# Altium schematic sheet [03] - 28PINS SCHEMATIC.SchDoc (part 3 of 3)
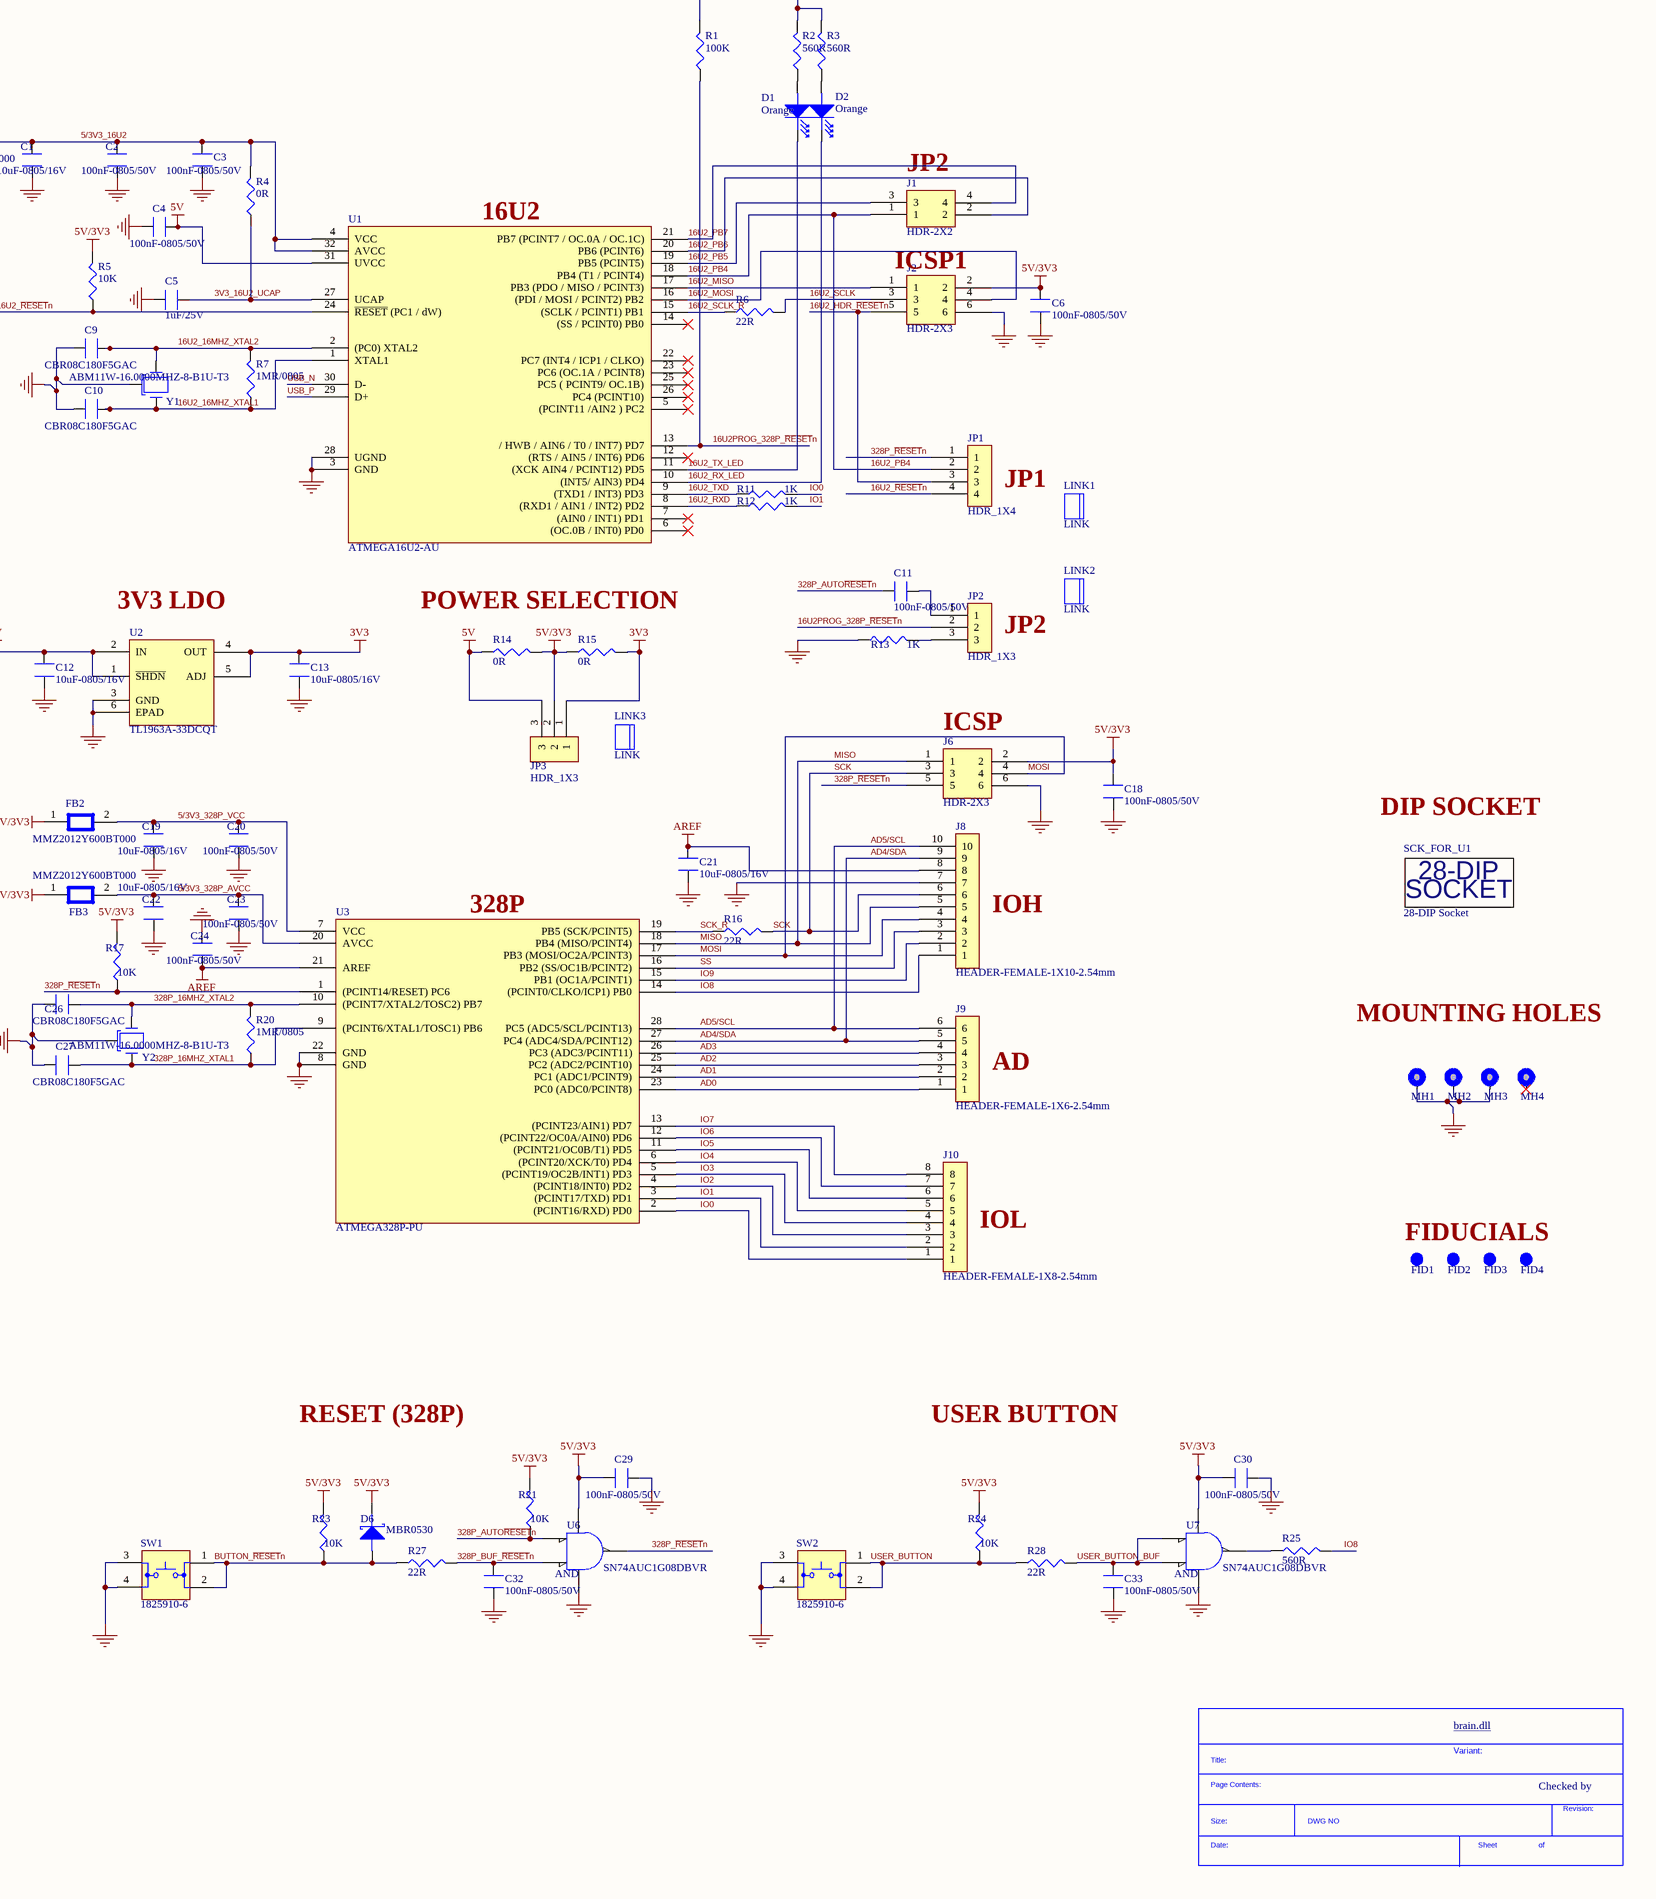
[diagram p5: [03] - 28PINS SCHEMATIC.SchDoc, bottom right]

## Library data of the parts (continued)
U2 = TL1963A-33DCQT: Single Output LDO, 1.5A, 3.3V Fast Trans; Manufacturer: Texas Instruments; Number of Outputs: 1; Dropout Voltage: 340mV; Max Input Voltage: 20V; Min Input Voltage: 2.1V; Min Current Limit: 1.6A; Polarity: Positive; Accuracy: 3%; Quiescent Current: 1mA; Power Supply Rejection Ratio (PSRR): 63dB; Output Type: Fixed; Supplier 1: Digi-Key; Manufacturer Part Number: TL1963A-33DCQT; RoHS: Yes; Category: Voltage Regulators - Linear; Stock 1: 528; Pricing 1: 1=4,08000, 10=3,66600, 25=3,46560, 100=3,00340 (USD); Case/Package: SOT-223; Number of Pins: 6; Contact Plating: Gold; Min Operating Temperature: -40°C; Max Operating Temperature: 125°C; Packaging: Tape and Reel; Output Voltage: 3.3V; Output Current: 1.5A; Package Quantity: 250; Max Output Current: 1.5A; Number of Regulators: 1; Max Output Voltage: 3.3V; Min Output Voltage: 3.3V; Series: -; Radiation Hardening: No; Lead Free: Lead Free; RoHS Compliant: Yes; ComponentLink1URL: https://datasheet.ciiva.com/14279/tl1963a-33-14279286.pdf?src-supplier=Avnet; ComponentLink1Description: https://datasheet.ciiva.com/14279/tl1963a-33-14279286.pdf?src-supplier=Avnet; ComponentLink2URL: https://datasheet.ciiva.com/6591/tl1963a-6591431.pdf?src-supplier=Digi-Key; ComponentLink2Description: https://datasheet.ciiva.com/6591/tl1963a-6591431.pdf?src-supplier=Digi-Key; ComponentLink3URL: https://datasheet.ciiva.com/26176/tl1963a-25-26176573.pdf?src-supplier=Avnet+Europe; ComponentLink3Description: https://datasheet.ciiva.com/26176/tl1963a-25-26176573.pdf?src-supplier=Avnet+Europe; ComponentLink4URL: https://datasheet.ciiva.com/6591/tl1963a-6591406.pdf?src-supplier=Digi-Key; ComponentLink4Description: https://datasheet.ciiva.com/6591/tl1963a-6591406.pdf?src-supplier=Digi-Key; ComponentLink5URL: https://datasheet.ciiva.com/6591/tl1963a-6591407.pdf?src-supplier=Digi-Key; ComponentLink5Description: https://datasheet.ciiva.com/6591/tl1963a-6591407.pdf?src-supplier=Digi-Key; Supplier Part Number 1: 296-32342-1-ND
U3 = ATMEGA328P-PU: IC MCU 8BIT 32KB FLASH 28DIP; Manufacturer: Microchip / Atmel; RAM Size: 2KB; Number of Timers/Counters: 3; Min Supply Voltage: 1.8V; Max Supply Voltage: 5.5V; Interface: I2C,SPI,UART,USART,2-Wire; Number of I/Os: 23; Frequency: 20MHz; Oscillator Type: Internal; Data Bus Width: 8b; Watchdog Timer: Yes; Peripherals: Brown-out Detect/Reset,POR,PWM,WDT; Core Architecture: AVR; Number of PWM Channels: 6; Number of SPI Channels: 1; Supplier 1: Allied Electronics; Manufacturer Part Number: ATMEGA328P-PU; RoHS: Yes; Category: Microcontrollers; Mount: Through Hole; Case/Package: PDIP; Number of Pins: 28; Contact Plating: Tin,Matte; Min Operating Temperature: -40°C; Max Operating Temperature: 85°C; Packaging: Rail/Tube; Package Quantity: 14; Number of Programmable I/O: 23; Max Frequency: 20MHz; Memory Type: FLASH; Memory Size: 32KB; Series: AVR® ATmega; Number of ADC Channels: 6; Number of I2C Channels: 1; Length: 37.4mm; Width: 6.76mm; Height: 3.28mm; Radiation Hardening: No; RoHS Compliant: Yes; REACH SVHC: No SVHC; Lead Free: Lead Free; ComponentLink1URL: https://datasheet.ciiva.com/19457/2139111-19457070.pdf?src-supplier=Jameco; ComponentLink1Description: https://datasheet.ciiva.com/19457/2139111-19457070.pdf?src-supplier=Jameco; ComponentLink2URL: https://datasheet.ciiva.com/1157/1684409-1157696.pdf?src-supplier=Element14; ComponentLink2Description: https://datasheet.ciiva.com/1157/1684409-1157696.pdf?src-supplier=Element14; ComponentLink3URL: https://datasheet.ciiva.com/20168/73-4283-20168380.pdf?src-supplier=Rapid+Electronics; ComponentLink3Description: https://datasheet.ciiva.com/20168/73-4283-20168380.pdf?src-supplier=Rapid+Electronics; ComponentLink4URL: https://datasheet.ciiva.com/29119/155197-da-01-en-microcontr-atmega328p-pu-8bit-pdip-28-29119593.pdf?src-supplier=Conrad; ComponentLink4Description: https://datasheet.ciiva.com/29119/155197-da-01-en-microcontr-atmega328p-pu-8bit-pdip-28-29119593.pdf?src-supplier=Conrad; ComponentLink5URL: https://datasheet.ciiva.com/26818/atmega328p-pu-26818578.pdf?src-supplier=IIIC; ComponentLink5Description: https://datasheet.ciiva.com/26818/atmega328p-pu-26818578.pdf?src-supplier=IIIC; ComponentLink6URL: https://datasheet.ciiva.com/15213/getdatasheetpartid-318533-15213133.pdf?src-supplier=Verical; ComponentLink6Description: https://datasheet.ciiva.com/15213/getdatasheetpartid-318533-15213133.pdf?src-supplier=Verical; Supplier: Ozdisan; Supplier Part Number 1: 70332157
U4-U7 = SN74AUC1G08DBVR: LOGIC, 74AUC1G, AND GATE, SOT23-5; Manufacturer: Texas Instruments; Min Supply Voltage: 800mV; Max Supply Voltage: 2.7V; Quiescent Current: 10uA; Number of Inputs: 2; Propagation Delay: 2ns; Number of Outputs: 1; High Level Output Current: -9mA; Low Level Output Current: 9mA; Turn-On Delay Time: 2.4ns; Schmitt Trigger Input: No; Input Type: DIFFERENTIAL; Supplier 1: Digi-Key; Manufacturer Part Number: SN74AUC1G08DBVR; RoHS: Yes; Category: Logic Gates; Stock 1: 21198; Pricing 1: 1=0,43000, 10=0,34900, 25=0,31920, 100=0,23740, 250=0,21520, 500=0,17808, 1000=0,13356 (USD); Mount: Surface Mount; Case/Package: SOT-23; Number of Pins: 5; Weight: 0.000395oz; Contact Plating: Gold; Min Operating Temperature: -40°C; Max Operating Temperature: 85°C; Logic Function: AND GATE; Package Quantity: 3000; Packaging: Tape and Reel; Number of Circuits: 1; Number of Gates: 1; Number of Input Lines: 2; Number of Output Lines: 1; Number of Elements: 1; Series: 74AUC; Technology: CMOS; Output Current: 9mA; Number of Bits: 1; Max Output Current: 9mA; Termination: SMD/SMT; Length: 3.05mm; Width: 1.75mm; Height: 1.3mm; Radiation Hardening: No; Lead Free: Lead Free; RoHS Compliant: Yes; REACH SVHC: No SVHC; ComponentLink1URL: https://datasheet.ciiva.com/4216/1146sn74auc1g08-4216507.pdf?src-supplier=Arrow+Electronics; ComponentLink1Description: https://datasheet.ciiva.com/4216/1146sn74auc1g08-4216507.pdf?src-supplier=Arrow+Electronics; ComponentLink2URL: https://datasheet.ciiva.com/6124/1775236-6124395.pdf?src-supplier=Farnell; ComponentLink2Description: https://datasheet.ciiva.com/6124/1775236-6124395.pdf?src-supplier=Farnell; ComponentLink3URL: https://datasheet.ciiva.com/23844/1634288-23844654.pdf?src-supplier=Newark; ComponentLink3Description: https://datasheet.ciiva.com/23844/1634288-23844654.pdf?src-supplier=Newark; ComponentLink4URL: https://datasheet.ciiva.com/1864/sn74auc1g08-1864662.pdf?src-supplier=Digi-Key; ComponentLink4Description: https://datasheet.ciiva.com/1864/sn74auc1g08-1864662.pdf?src-supplier=Digi-Key; ComponentLink5URL: https://datasheet.ciiva.com/1864/sn74auc1g08-1864663.pdf?src-supplier=Digi-Key; ComponentLink5Description: https://datasheet.ciiva.com/1864/sn74auc1g08-1864663.pdf?src-supplier=Digi-Key; ComponentLink6URL: https://datasheet.ciiva.com/1864/sn74auc1g08-1864664.pdf?src-supplier=Digi-Key; ComponentLink6Description: https://datasheet.ciiva.com/1864/sn74auc1g08-1864664.pdf?src-supplier=Digi-Key; ComponentLink7URL: https://datasheet.ciiva.com/14292/sn74auc1g08-14292269.pdf?src-supplier=Avnet; ComponentLink7Description: https://datasheet.ciiva.com/14292/sn74auc1g08-14292269.pdf?src-supplier=Avnet; Supplier Part Number 1: 296-13170-1-ND
Y1 Y2 = ABM11W-16.0000MHZ-8-B1U-T3: Iot Optimized 16MHZ 8PF Crystal; pin to pad: 2>2+4; Manufacturer: Abracon; Supplier 1: Digi-Key; Manufacturer Part Number: ABM11W-16.0000MHZ-8-B1U-T3; RoHS: Yes; Category: Crystals; Stock 1: 1980; Pricing 1: 1=0,75000, 10=0,66200, 50=0,61920, 100=0,54720, 500=0,51840, 1000=0,43200 (USD); RoHS Compliant: Yes; ComponentLink1URL: https://abracon.com/Resonators/ABM11W.pdf?src-supplier=Digi-Key; ComponentLink1Description: https://abracon.com/Resonators/ABM11W.pdf?src-supplier=Digi-Key; Supplier Part Number 1: 535-13813-1-ND
Z1 Z2 = CGA0603MLC-05E: ESD Suppressor TVS Bi-Dir 5V Automotive 2-Pin Case 0603(1608Metric) T/R; Manufacturer: Bourns; Capacitance: 0.2pF; Direction: Bidirectional; Number of Circuits: 1; Clamping Voltage: 30V; Current Rating: 5nA; Leakage Current: 10nA; ESD Protection: Yes; Element Configuration: Single; Supplier 1: Digi-Key; Manufacturer Part Number: CGA0603MLC-05E; RoHS: Yes; Category: Varistors; Stock 1: 6992; Pricing 1: 1=0,58000, 10=0,45400, 25=0,38280, 100=0,31150, 250=0,25808, 500=0,21360, 1000=0,16020, 2500=0,14685 (USD); Mount: Surface Mount; Case/Package: 0603; Number of Pins: 2; Case Code (Metric): 1608; Case Code (Imperial): 0603; Contact Plating: Tin; Min Operating Temperature: -55°C; Max Operating Temperature: 125°C; Operating Supply Voltage: 5V; Voltage Rating (DC): 5V; Packaging: Tape and Reel; Package Quantity: 5000; Max Voltage Rating (DC): 5V; Termination: SMD/SMT; Working Voltage: 5V; Max Reverse Leakage Current: 5nA; Length: 1.6mm; Width: 0.85mm; Height: 0.51mm; Depth: 0.85mm; Radiation Hardening: No; REACH SVHC: No SVHC; RoHS Compliant: Yes; ComponentLink1URL: https://datasheet.ciiva.com/24142/bourns-cga-mlc-280156-24142144.pdf?src-supplier=Mouser; ComponentLink1Description: https://datasheet.ciiva.com/24142/bourns-cga-mlc-280156-24142144.pdf?src-supplier=Mouser; ComponentLink2URL: https://datasheet.ciiva.com/30479/0900766b81295add-30479028.pdf?src-supplier=RSComponents; ComponentLink2Description: https://datasheet.ciiva.com/30479/0900766b81295add-30479028.pdf?src-supplier=RSComponents; ComponentLink3URL: https://datasheet.ciiva.com/28475/1772768-28475109.pdf?src-supplier=Element14; ComponentLink3Description: https://datasheet.ciiva.com/28475/1772768-28475109.pdf?src-supplier=Element14; ComponentLink4URL: https://datasheet.ciiva.com/30009/cga-mlc-30009944.pdf?src-supplier=Avnet; ComponentLink4Description: https://datasheet.ciiva.com/30009/cga-mlc-30009944.pdf?src-supplier=Avnet; Supplier Part Number 1: CGA0603MLC-05ECT-ND